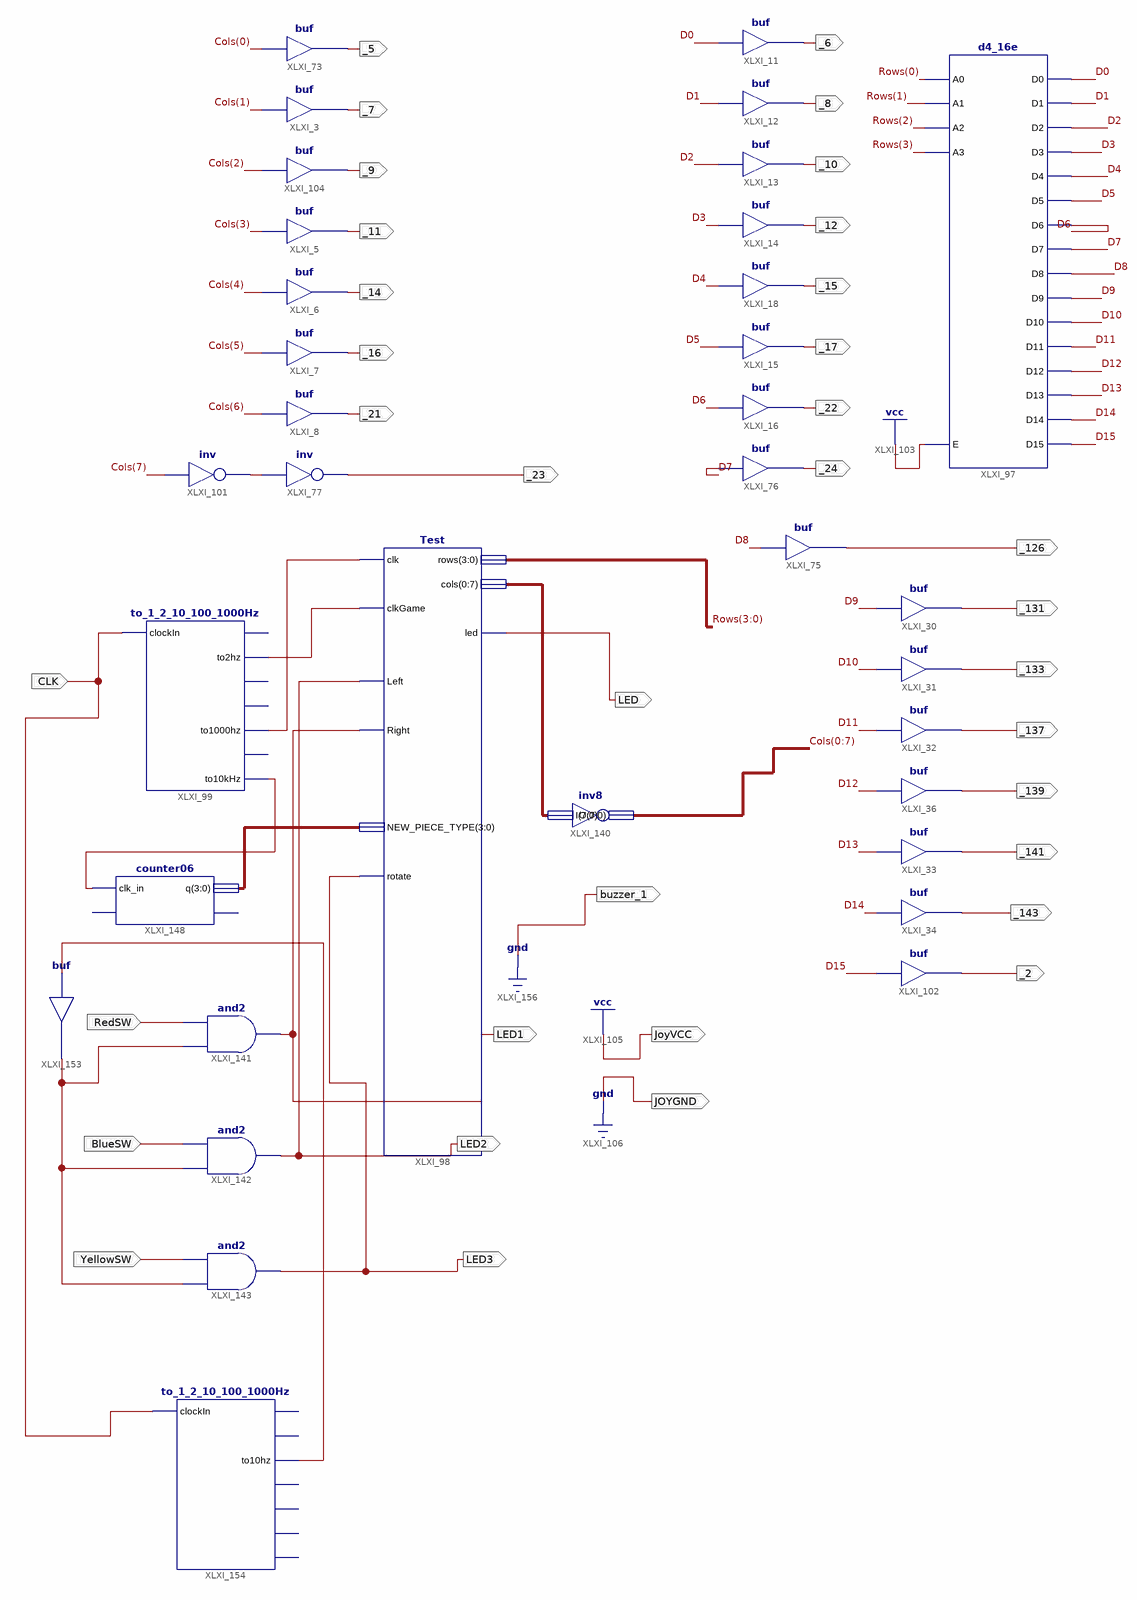
[diagram p0: schematic sheet 1]
// Xilinx ISE schematic main.sch (spartan6) as structural Verilog: 35 symbols, 35 ports
module main (
  input  CLK,
  input  RedSW,
  input  YellowSW,
  input  BlueSW,
  output _5,
  output _7,
  output _9,
  output _11,
  output _14,
  output _16,
  output _21,
  output _23,
  output _6,
  output _8,
  output _10,
  output _12,
  output _15,
  output _17,
  output _22,
  output _24,
  output _2,
  output _143,
  output _141,
  output _139,
  output _137,
  output _133,
  output _131,
  output _126,
  output LED,
  output LED1,
  output LED2,
  output LED3,
  output JoyVCC,
  output JOYGND,
  output buzzer_1
);

  wire D0, D1, D2, D3, D4, D5, D6, D7, D8, D9, D10, D11, D12, D13, D14, D15, XLXN_104, XLXN_227, XLXN_240,
       XLXN_273, XLXN_274, XLXN_280;
  wire [3:0] Rows, XLXN_223;
  wire [7:0] Cols, XLXN_206;

  buf XLXI_3 (_7, Cols[1]);
  buf XLXI_5 (_11, Cols[3]);
  buf XLXI_6 (_14, Cols[4]);
  buf XLXI_7 (_16, Cols[5]);
  buf XLXI_8 (_21, Cols[6]);
  buf XLXI_11 (_6, D0);
  buf XLXI_12 (_8, D1);
  buf XLXI_13 (_10, D2);
  buf XLXI_14 (_12, D3);
  buf XLXI_15 (_17, D5);
  buf XLXI_16 (_22, D6);
  buf XLXI_18 (_15, D4);
  buf XLXI_73 (_5, Cols[0]);
  buf XLXI_76 (_24, D7);
  not XLXI_77 (_23, XLXN_104);
  buf XLXI_75 (_126, D8);
  buf XLXI_34 (_143, D14);
  buf XLXI_33 (_141, D13);
  buf XLXI_36 (_139, D12);
  buf XLXI_32 (_137, D11);
  buf XLXI_31 (_133, D10);
  buf XLXI_30 (_131, D9);
  d4_16e XLXI_97 (
    .A0(Rows[0]), .A1(Rows[1]), .A2(Rows[2]), .A3(Rows[3]), .E(1'b1), .D0(D0), .D1(D1), .D10(D10), .D11(D11),
    .D12(D12), .D13(D13), .D14(D14), .D15(D15), .D2(D2), .D3(D3), .D4(D4), .D5(D5), .D6(D6), .D7(D7),
    .D8(D8), .D9(D9));
  Test XLXI_98 (
    .clk(XLXN_274), .clkGame(XLXN_273), .Left(LED2), .Right(LED1), .rotate(LED3), .NEW_PIECE_TYPE(XLXN_223),
    .led(LED), .rows(Rows),
    .cols({XLXN_206[0], XLXN_206[1], XLXN_206[2], XLXN_206[3], XLXN_206[4], XLXN_206[5], XLXN_206[6], XLXN_206[7]}));
  not XLXI_101 (XLXN_104, Cols[7]);
  buf XLXI_102 (_2, D15);
  buf XLXI_104 (_9, Cols[2]);
  inv8 XLXI_140 (
    .I({XLXN_206[0], XLXN_206[1], XLXN_206[2], XLXN_206[3], XLXN_206[4], XLXN_206[5], XLXN_206[6], XLXN_206[7]}),
    .O({Cols[0], Cols[1], Cols[2], Cols[3], Cols[4], Cols[5], Cols[6], Cols[7]}));
  and XLXI_142 (LED2, XLXN_240, BlueSW);
  and XLXI_141 (LED1, XLXN_240, RedSW);
  and XLXI_143 (LED3, XLXN_240, YellowSW);
  counter06 XLXI_148 (.clk_in(XLXN_227), .q(XLXN_223));  // open: clear, divide_7
  to_1_2_10_100_1000Hz XLXI_99 (
    .clockIn(CLK), .to1000hz(XLXN_274), .to10kHz(XLXN_227), .to2hz(XLXN_273));  // open: to100hz, to10hz, to1hz, to20Hz
  buf XLXI_153 (XLXN_240, XLXN_280);
  to_1_2_10_100_1000Hz XLXI_154 (
    .clockIn(CLK), .to10hz(XLXN_280));  // open: to1000hz, to100hz, to10kHz, to1hz, to20Hz, to2hz

  assign buzzer_1 = 1'b0;
  assign JOYGND = 1'b0;
  assign JoyVCC = 1'b1;
endmodule
